# Altium schematic sheet Power.SchDoc: CPCI-Serial Backplane
size 420 x 297 mm; Date: 06/04/2023; CheckedBy: EG; GD; GK; MS; DrawnBy: M. Gąska; Address1: European Organization for Nuclear Research; Address2: CH-1211 Geneve 23 - Switzerland; DocumentNumber: 2; Revision: 2; SheetNumber: 2; SheetTotal: 5; Projet: DI/OT Crate; DivGrp: BE-CO; Title2: Power; Designer: G.Daniluk; ModifiedBy: M.Fafara; CreateDate: 06/04/2023; CheckedDate: 06/04/2023
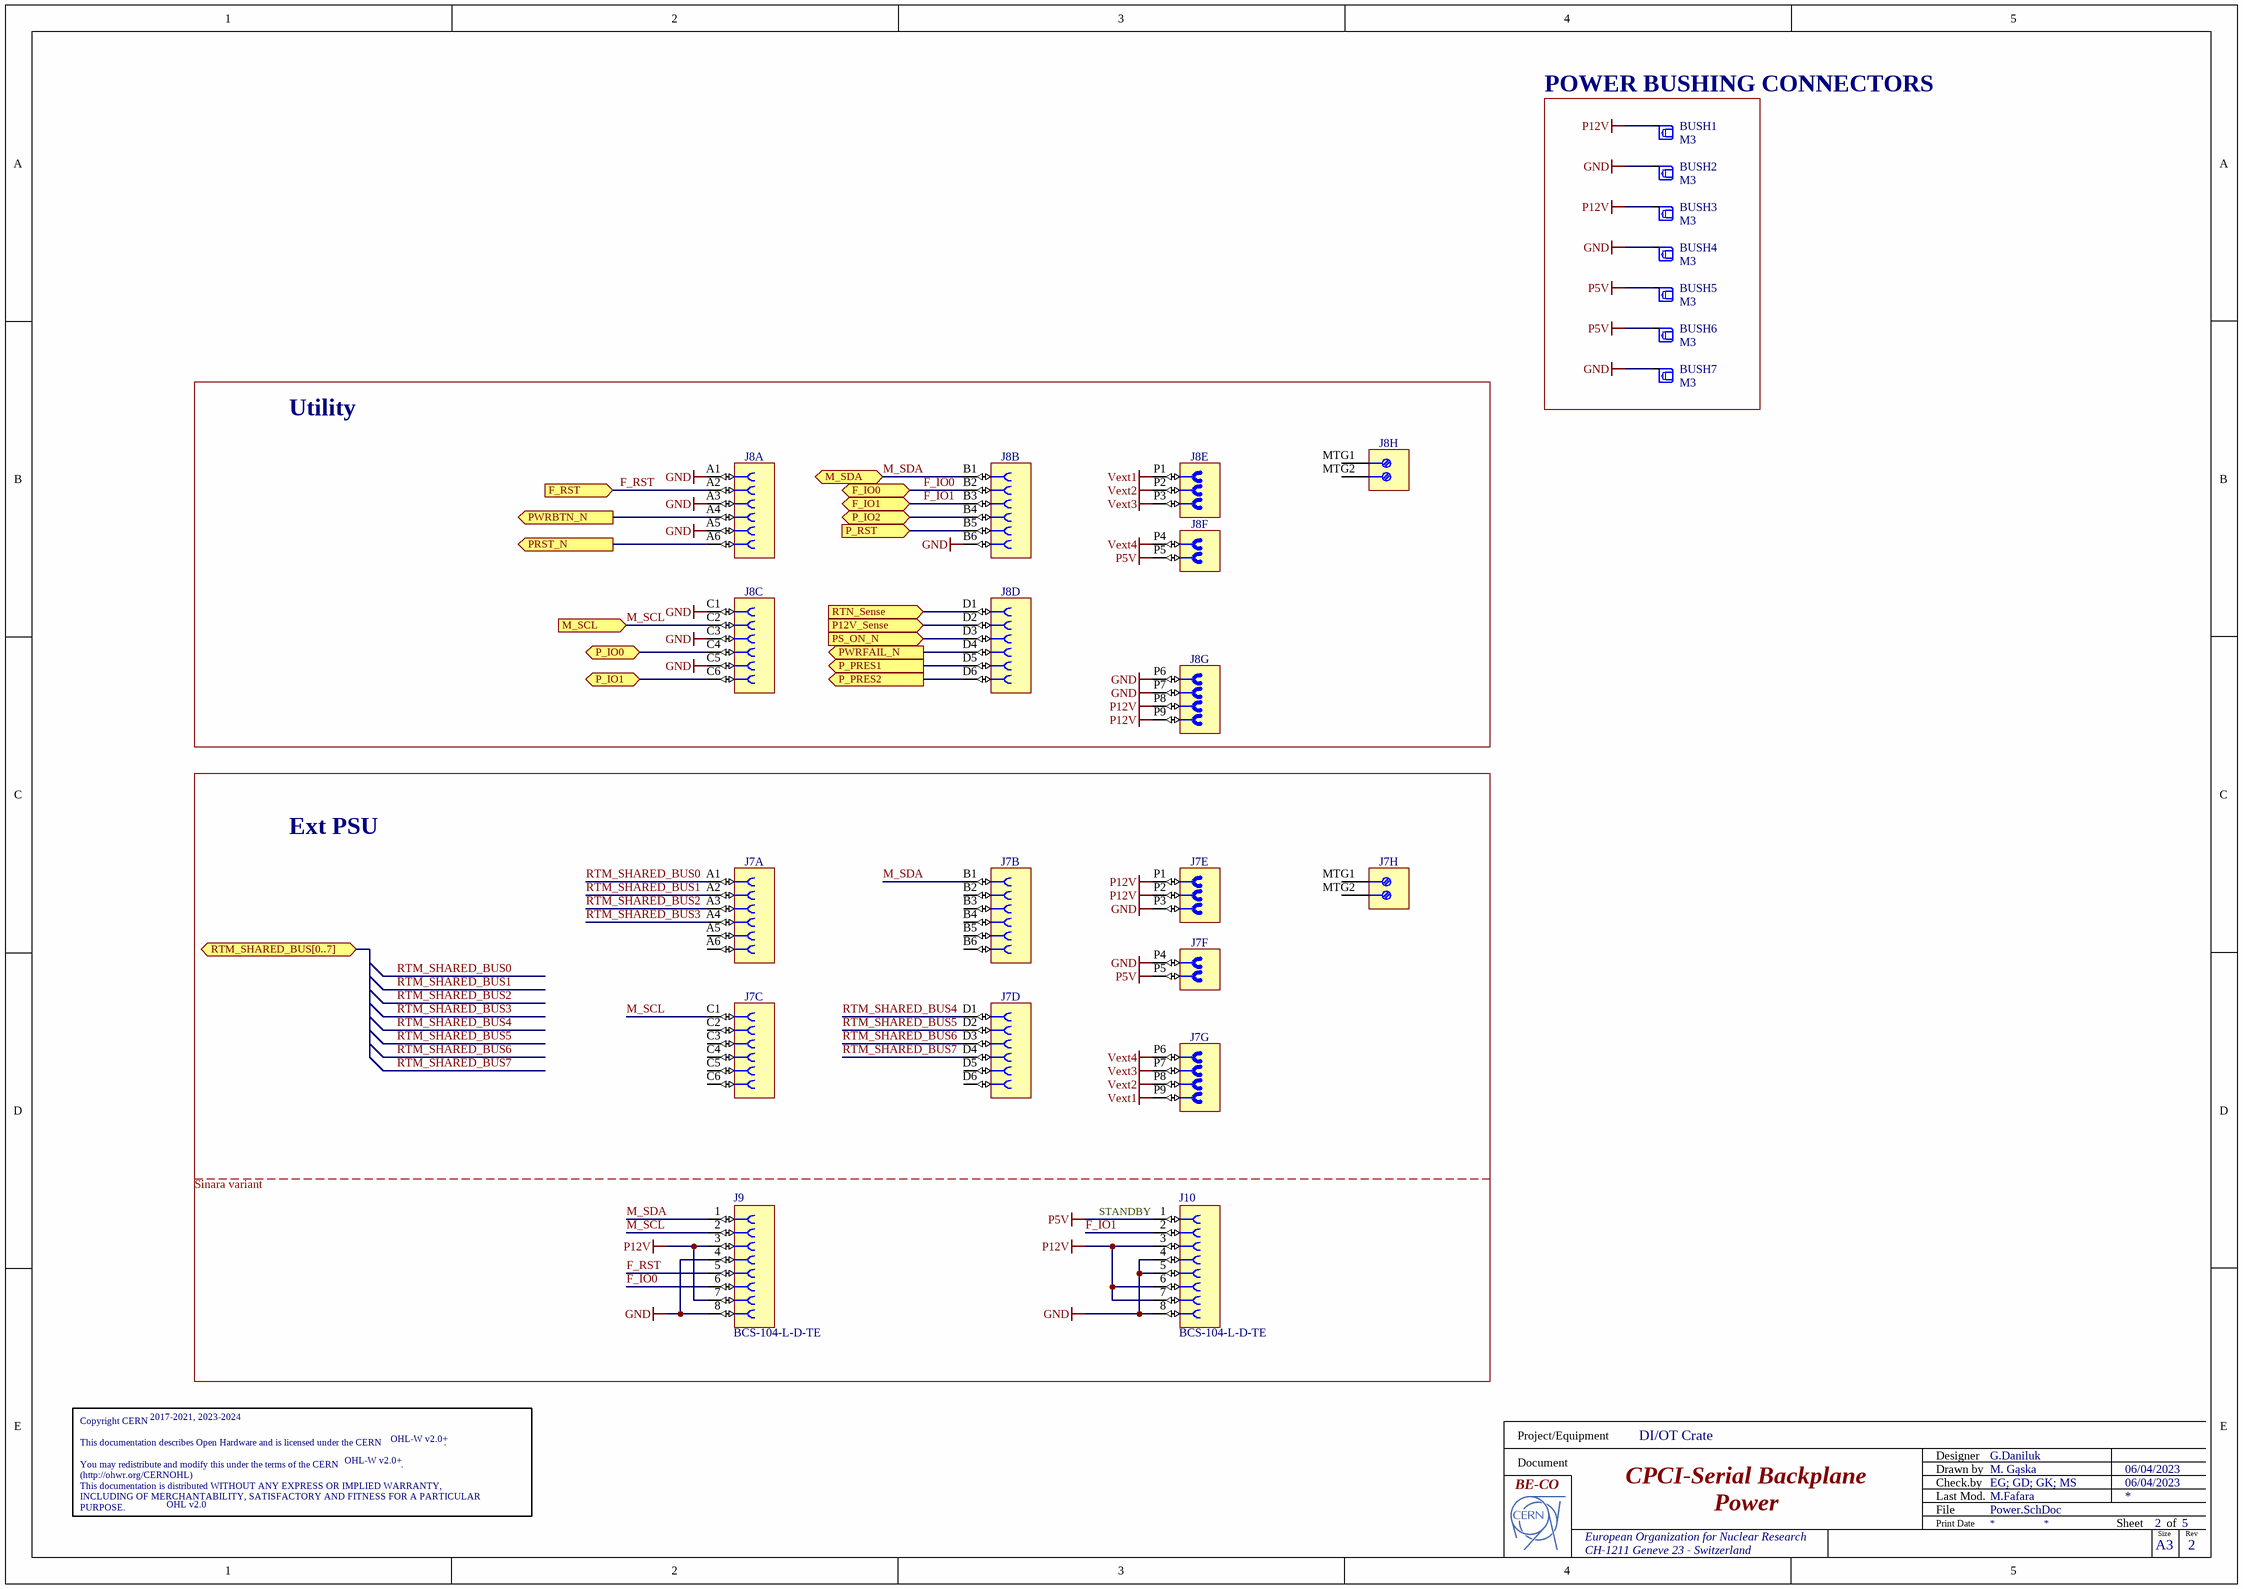
[diagram p0: Power.SchDoc]

## Parts
BUSH1  M3  [WURTH_7461057]
BUSH2  M3  [WURTH_7461057]
BUSH3  M3  [WURTH_7461057]
BUSH4  M3  [WURTH_7461057]
BUSH5  M3  [WURTH_7461057]
BUSH6  M3  [WURTH_7461057]
BUSH7  M3  [WURTH_7461057]
CERN_OHL  CERN_OHL  [CERN_OHL]  (value not drawn)  (graphical)
J7  PwrBlade  [AMPHENOL_51940-650]  (value not drawn)  (parts A,B,C,D,E,F,G,H of 8)
J8  PwrBlade  [AMPHENOL_51940-650]  (value not drawn)  (parts A,B,C,D,E,F,G,H of 8)
J9  BCS-104-L-D-TE  [SAMTEC_BCS-104-L-D-TE]
J10  BCS-104-L-D-TE  [SAMTEC_BCS-104-L-D-TE]

## Blocks framed on the sheet
POWER BUSHING CONNECTORS: BUSH1-BUSH7
Utility: J8
Ext PSU: J7 J9 J10

## Ports
F_IO0 (bidir), F_IO1 (bidir), F_RST (in), M_SCL (in), M_SDA (bidir), P12V_Sense (in), P_IO0 (bidir), P_IO1 (bidir), P_IO2 (bidir), P_PRES1 (out), P_PRES2 (out), P_RST (in), PRST_N (out), PS_ON_N (in), PWRBTN_N (out), PWRFAIL_N (out), RTM_SHARED_BUS[0..7] (bidir), RTN_Sense (in)

## Nets
GND: BUSH2.1 BUSH4.1 BUSH7.1 J7.P3 J7.P4 J8.A1 J8.A3 J8.A5 J8.B6 J8.C1 J8.C3 J8.C5 J8.P6 J8.P7 J9.4 J9.8 J10.4 J10.5 J10.8
P5V: BUSH5.1 BUSH6.1 J7.P5 J8.P5 J10.1
P12V: BUSH1.1 BUSH3.1 J7.P1 J7.P2 J8.P8 J8.P9 J9.3 J9.7 J10.3 J10.6 J10.7
Vext1: J7.P9 J8.P1
Vext2: J7.P8 J8.P2
Vext3: J7.P7 J8.P3
Vext4: J7.P6 J8.P4
F_IO0: J8.B2 J9.6 ; port F_IO0
F_IO1: J8.B3 J10.2 ; port F_IO1
F_RST: J8.A2 J9.5 ; port F_RST
M_SCL: J7.C1 J8.C2 J9.2 ; port M_SCL
M_SDA: J7.B1 J8.B1 J9.1 ; port M_SDA
P12V_Sense: J8.D2 ; port P12V_Sense
P_IO0: J8.C4 ; port P_IO0
P_IO1: J8.C6 ; port P_IO1
P_IO2: J8.B4 ; port P_IO2
P_PRES1: J8.D5 ; port P_PRES1
P_PRES2: J8.D6 ; port P_PRES2
P_RST: J8.B5 ; port P_RST
PRST_N: J8.A6 ; port PRST_N
PS_ON_N: J8.D3 ; port PS_ON_N
PWRBTN_N: J8.A4 ; port PWRBTN_N
PWRFAIL_N: J8.D4 ; port PWRFAIL_N
RTM_SHARED_BUS0: J7.A1
RTM_SHARED_BUS1: J7.A2
RTM_SHARED_BUS2: J7.A3
RTM_SHARED_BUS3: J7.A4
RTM_SHARED_BUS4: J7.D1
RTM_SHARED_BUS5: J7.D2
RTM_SHARED_BUS6: J7.D3
RTM_SHARED_BUS7: J7.D4
RTN_Sense: J8.D1 ; port RTN_Sense

Not connected (* = marked no-connect by the designer): J7 A5 A6 B2 B3 B4 B5 B6 C2 C3 C4 C5 C6 D5 D6 MTG1 MTG2; J8 MTG1 MTG2

## Notes on the sheet
- Sinara variant
- (near J10) STANDBY
- Project/Equipment
- Document
- Designer
- Drawn by
- Check.by
- File
- Last Mod.
- Print Date
- Sheet
- Size
- A3
- of
- Rev
- (in symbol CERN_OHL) Copyright CERN / This documentation describes Open Hardware and is licensed under the CERN                         . / You may redistribute and modify this under the terms of the CERN                         . / (http://ohwr.org/CERNOHL) / This documentation is distributed WITHOUT ANY EXPRESS OR IMPLIED WARRANTY, / INCLUDING OF MERCHANTABILITY, SATISFACTORY AND FITNESS FOR A PARTICULAR PURPOSE. / Please see the CERN                   for applicable conditions.

## Library data of the parts
BUSH1-BUSH7 = WURTH_7461057: Bush; Part Description: REDCUBE Bush with Threaded Hole M3 and Two Rows Press-Fit Pin-Plate, WP-BUTR Series; Manufacturer: WURTH; Part Number: WURTH_7461057; Component Kind: Standard; Component Type: Standard; Pin Count: 6; PackageDescription: 7x7x6mm REDCUBE Press-Fit with Internsl Threaded Hole M3,Two Rows Pin-Plate WP-BUTR; Mounted: Yes; Socket: No; SMD: No; PressFit: Yes; Sense: No; Status: None; Value: M3; Manufacturer Part Number: 7461057; ComponentHeight: 6mm; HelpURL: \\cern.ch\dfs\Applications\Altium\Datasheets\WURTH_7461057.pdf; Author: CERN DEM JLC; CreateDate: 13.08.2018; LatestRevisionDate: 13.08.2018
CERN_OHL = CERN_OHL: Part Description: Copyright CERN; OHL_License: OHL-W v2.0+; OHL_Version: OHL v2.0; Mounted: No; OHL_Date: 2017-2021, 2023-2024; Part Number: CERN_OHL; Component Type: Standard (No BOM); Pin Count: 0; Socket: No; SMD: No; Sense: No; Status: None; ComponentHeight: 0mm; HelpURL: Undefined; Author: CERN DEM HF; CreateDate: 03/12/2021; LatestRevisionDate: 03/12/2021; PackageDescription: Texte Copyright Cern
J7 J8 = AMPHENOL_51940-650: Thru-Hole, Lead 3.43mm, PowerBlade Vertical Power Connector 3ACP 2P 24S 4DCP Contacts; Part Description: Vertical PowerBlade Power Connector 3ACP + 2P + 24S + 4DCP PressFit Contacts; Part Number: AMPHENOL_51940-650; Component Kind: Standard; Component Type: Standard; Pin Count: 28; Family: PwrBlade; Mounted: Yes; Socket: No; SMD: No; PressFit: Yes; Sense: No; Status: None; Manufacturer: AMPHENOL; Manufacturer Part Number: 51940-650; ComponentHeight: 12.7mm; HelpURL: \\cern.ch\dfs\Applications\Altium\Datasheets\AMPHENOL_51940-650.pdf; Author: CERN DEM HF
  J7: CreateDate: 13.12.2022; LatestRevisionDate: 13.12.2022
  J8: CreateDate: 13/12/2022; LatestRevisionDate: 13/12/2022
J9 J10 = CMP-002-04655-3: Board Connector, 8 Contact(s), 2 Row(s), Female, Straight, 0.1 inch Pitch, Solder Terminal, Black Insulator, Plug; Max Operating Temperature: 125°C; Min Operating Temperature: -65°C; Mounting Technology: Board; RoHS Compliant: Yes; Connector Type: BOARD CONNECTOR